# EAGLE design MicroMod_Processor_STM32WB5MMG (EAGLE 9.6.2)
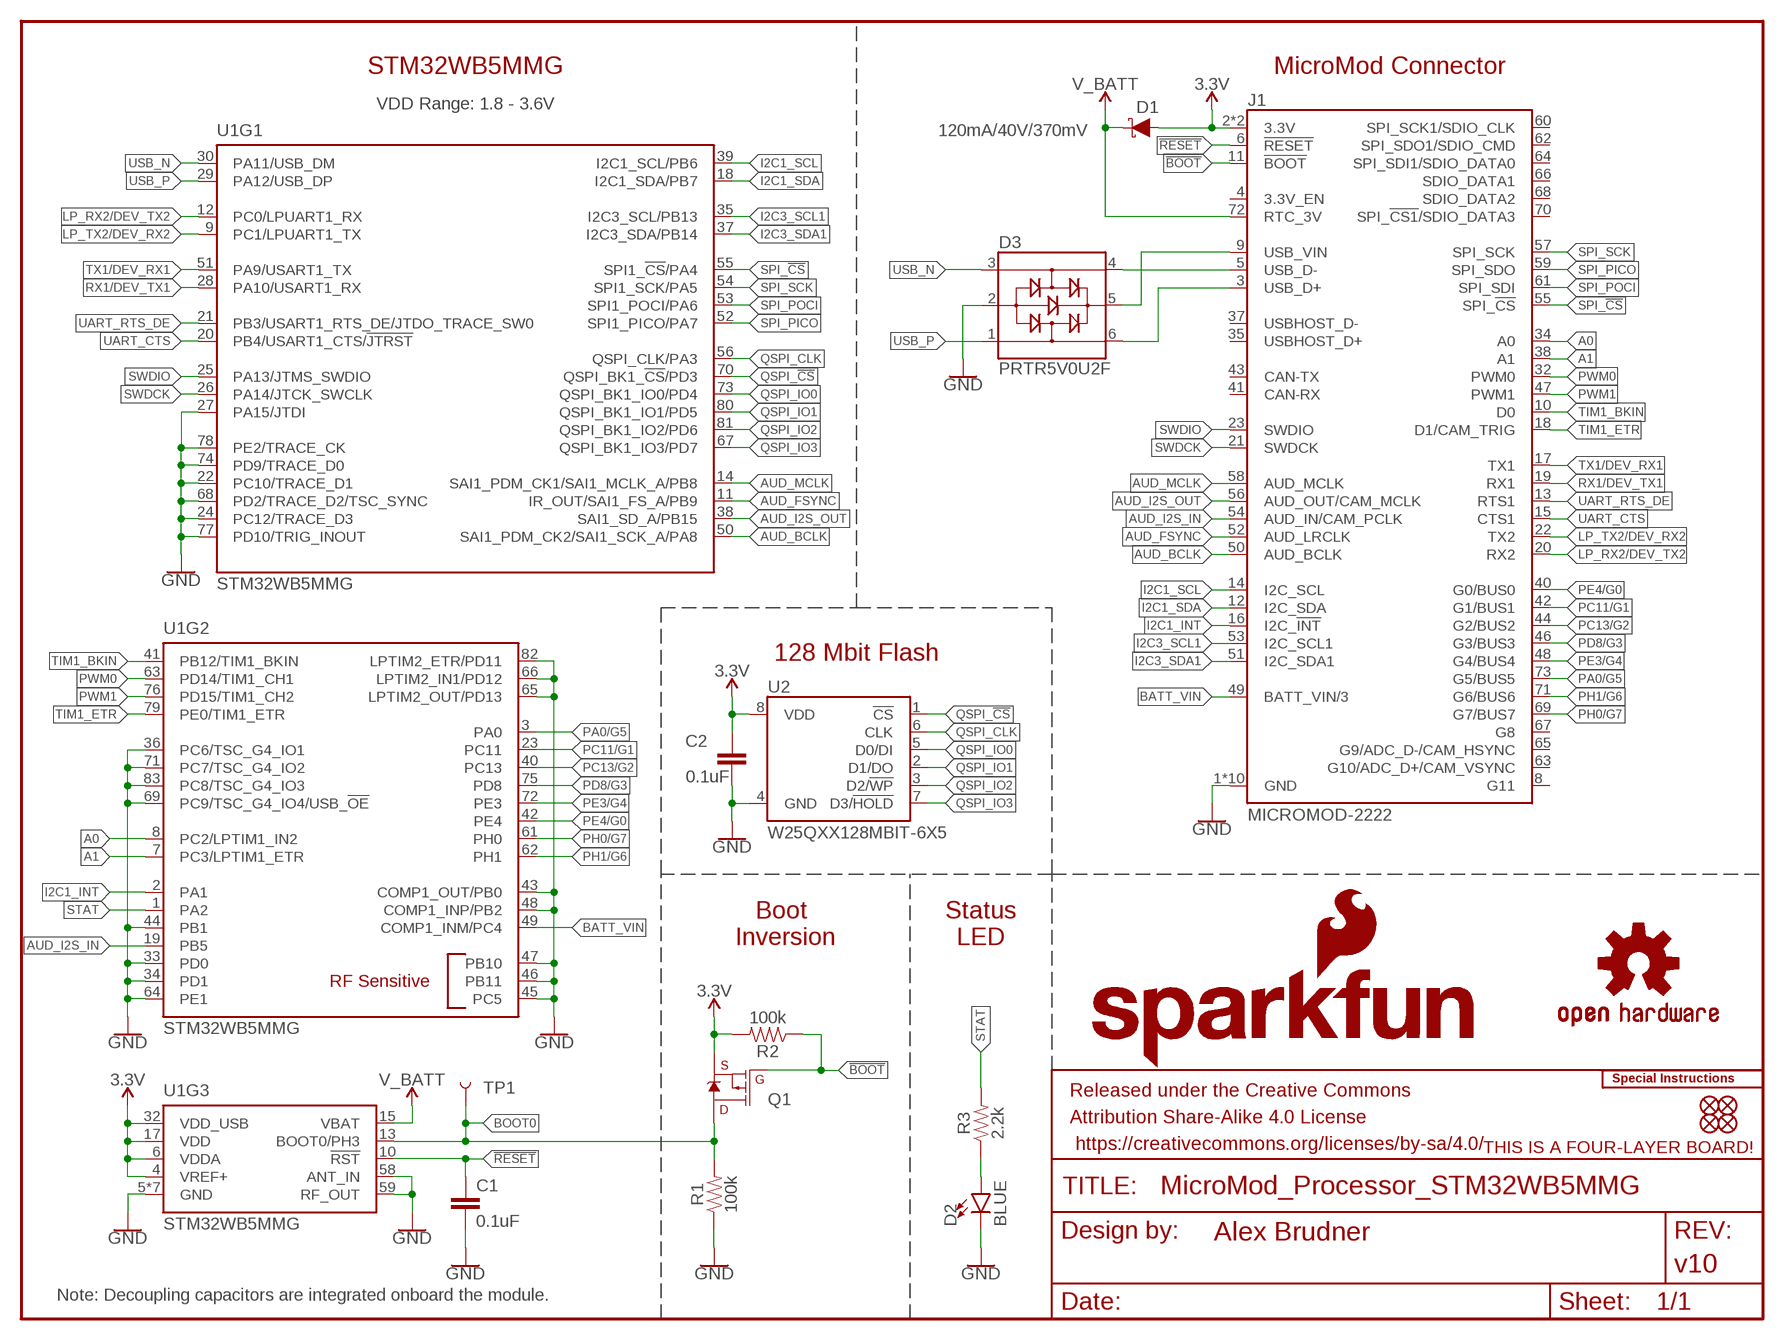
[diagram p0: schematic, sheet 1]

## Parts
C1  0.1uF  0.1UF-0402T-10V-10%-X7R  [0402-TIGHT]
C2  0.1uF  0.1UF-0402T-10V-10%-X7R  [0402-TIGHT]
D1  120mA/40V/370mV  DIODE-SCHOTTKY-RB751S40  [SOD-523]
D2  BLUE  LED-BLUE0603  [LED-0603]
D3  PRTR5V0U2F  [SOT886]
FD1  FIDUCIALUFIDUCIAL  [FIDUCIAL-MICRO]
FD2  FIDUCIALUFIDUCIAL  [FIDUCIAL-MICRO]
FD3  FIDUCIALUFIDUCIAL  [FIDUCIAL-MICRO]
FD4  FIDUCIALUFIDUCIAL  [FIDUCIAL-MICRO]
FRAME2  FRAME-LETTER  [CREATIVE_COMMONS]
J1  MICROMOD-2222  [M.2-CARD-E-22]
LOGO1  FOUR_LAYER_WARNING  [FOUR_LAYER_WARNING]
LOGO2  OSHW-LOGOMINI  [OSHW-LOGO-MINI]
LOGO3  SFE_LOGO_NAME_FLAME.1_INCH  [SFE_LOGO_NAME_FLAME_.1]
LOGO4  SPECIAL_INSTRUCTIONS-ORDERING  [ORDERING_INSTRUCTIONS]
Q1  20V/4.2A/52mΩ/1.4W  MOSFET_PCH-DMG2305UX-7  [SOT23-3]
R1  100k  100KOHM-0402T-1/16W-1%  [0402-TIGHT]
R2  100k  100KOHM-0402T-1/16W-1%  [0402-TIGHT]
R3  2.2k  2.2KOHM-0402T-1/16W-1%  [0402-TIGHT]
TP1  TEST-POINT3  [PAD.03X.03]
U1  STM32WB5MMG  STM32WB5MMG_LOGICAL  [SIP-LGA86]
U2  W25QXX128MBIT-6X5  [WSON-8-6X5]

## Nets
3.3V [Power]: C2.1 D1.A J1.2(3.3V) J1.74(3.3V) Q1.2(S) R2.2 U1.4(VREF+) U1.6(VDDA) U1.17(VDD) U1.32(VDD_USB) U2.8(VDD)
!BOOT!: J1.11(!BOOT!) Q1.1(G) R2.1
!RESET!: C1.1 J1.6(!RESET!) U1.10(!RST!)
A0: J1.34(A0) U1.8(PC2/LPTIM1_IN2)
A1: J1.38(A1) U1.7(PC3/LPTIM1_ETR)
AUD_BCLK: J1.50(AUD_BCLK) U1.50(SAI1_PDM_CK2/SAI1_SCK_A/PA8)
AUD_FSYNC: J1.52(AUD_LRCLK) U1.11(IR_OUT/SAI1_FS_A/PB9)
AUD_I2S_IN: J1.54(AUD_IN/CAM_PCLK) U1.19(PB5)
AUD_I2S_OUT: J1.56(AUD_OUT/CAM_MCLK) U1.38(SAI1_SD_A/PB15)
AUD_MCLK: J1.58(AUD_MCLK) U1.14(SAI1_PDM_CK1/SAI1_MCLK_A/PB8)
BATT_VIN: J1.49(BATT_VIN/3) U1.49(COMP1_INM/PC4)
BOOT0: Q1.3(D) R1.2 TP1.1 U1.13(BOOT0/PH3)
GND: C1.2 C2.2 D2.C D3.2 J1.1(GND) J1.7(GND) J1.33(GND) J1.36(GND) J1.39(GND) J1.45(GND) J1.75(GND) J1.GND1(GND) J1.GND2(GND) J1.GND3(GND) R1.1 U1.5(GND) U1.16(GND) U1.22(PC10/TRACE_D1) U1.24(PC12/TRACE_D3) U1.27(PA15/JTDI) U1.31(GND) U1.33(PD0) U1.34(PD1) U1.36(PC6/TSC_G4_IO1) U1.43(COMP1_OUT/PB0) U1.44(PB1) U1.45(PC5) U1.46(PB11) U1.47(PB10) U1.48(COMP1_INP/PB2) U1.57(GND) U1.58(ANT_IN) U1.59(RF_OUT) U1.60(GND) U1.64(PE1) U1.65(LPTIM2_OUT/PD13) U1.66(LPTIM2_IN1/PD12) U1.68(PD2/TRACE_D2/TSC_SYNC) U1.69(PC9/TSC_G4_IO4/USB_!OE!) U1.71(PC7/TSC_G4_IO2) U1.74(PD9/TRACE_D0) U1.77(PD10/TRIG_INOUT) U1.78(PE2/TRACE_CK) U1.82(LPTIM2_ETR/PD11) U1.83(PC8/TSC_G4_IO3) U1.84(GND) U1.86(GND) U2.4(GND)
I2C1_INT: J1.16(I2C_!INT!) U1.2(PA1)
I2C1_SCL: J1.14(I2C_SCL) U1.39(I2C1_SCL/PB6)
I2C1_SDA: J1.12(I2C_SDA) U1.18(I2C1_SDA/PB7)
I2C3_SCL1: J1.53(I2C_SCL1) U1.35(I2C3_SCL/PB13)
I2C3_SDA1: J1.51(I2C_SDA1) U1.37(I2C3_SDA/PB14)
LP_RX2/DEV_TX2: J1.20(RX2) U1.12(PC0/LPUART1_RX)
LP_TX2/DEV_RX2: J1.22(TX2) U1.9(PC1/LPUART1_TX)
N$1: D2.A R3.1
N$4: D3.5 J1.9(USB_VIN)
PA0/G5: J1.73(G5/BUS5) U1.3(PA0)
PC11/G1: J1.42(G1/BUS1) U1.23(PC11)
PC13/G2: J1.44(G2/BUS2) U1.40(PC13)
PD8/G3: J1.46(G3/BUS3) U1.75(PD8)
PE3/G4: J1.48(G4/BUS4) U1.72(PE3)
PE4/G0: J1.40(G0/BUS0) U1.42(PE4)
PH0/G7: J1.69(G7/BUS7) U1.61(PH0)
PH1/G6: J1.71(G6/BUS6) U1.62(PH1)
PWM0: J1.32(PWM0) U1.63(PD14/TIM1_CH1)
PWM1: J1.47(PWM1) U1.76(PD15/TIM1_CH2)
QSPI_!CS!: U1.70(QSPI_BK1_!CS!/PD3) U2.1(!CS!)
QSPI_CLK: U1.56(QSPI_CLK/PA3) U2.6(CLK)
QSPI_IO0: U1.73(QSPI_BK1_IO0/PD4) U2.5(D0/DI)
QSPI_IO1: U1.80(QSPI_BK1_IO1/PD5) U2.2(D1/DO)
QSPI_IO2: U1.81(QSPI_BK1_IO2/PD6) U2.3(D2/!WP!)
QSPI_IO3: U1.67(QSPI_BK1_IO3/PD7) U2.7(D3/!HOLD!)
RX1/DEV_TX1: J1.19(RX1) U1.28(PA10/USART1_RX)
SPI_!CS!: J1.55(SPI_!CS!) U1.55(SPI1_!CS!/PA4)
SPI_PICO: J1.59(SPI_SDO) U1.52(SPI1_PICO/PA7)
SPI_POCI: J1.61(SPI_SDI) U1.53(SPI1_POCI/PA6)
SPI_SCK: J1.57(SPI_SCK) U1.54(SPI1_SCK/PA5)
STAT: R3.2 U1.1(PA2)
SWDCK: J1.21(SWDCK) U1.26(PA14/JTCK_SWCLK)
SWDIO: J1.23(SWDIO) U1.25(PA13/JTMS_SWDIO)
TIM1_BKIN: J1.10(D0) U1.41(PB12/TIM1_BKIN)
TIM1_ETR: J1.18(D1/CAM_TRIG) U1.79(PE0/TIM1_ETR)
TX1/DEV_RX1: J1.17(TX1) U1.51(PA9/USART1_TX)
UART_CTS: J1.15(CTS1) U1.20(PB4/USART1_CTS/!JTRST!)
UART_RTS_DE: J1.13(RTS1) U1.21(PB3/USART1_RTS_DE/JTDO_TRACE_SW0)
USB_N [USB_Diff]: D3.3 U1.30(PA11/USB_DM)
USB_P [USB_Diff]: D3.1 U1.29(PA12/USB_DP)
USBIN_N [USB_Diff]: D3.4 J1.5(USB_D-)
USBIN_P [USB_Diff]: D3.6 J1.3(USB_D+)
V_BATT [Power]: D1.C J1.72(RTC_3V) U1.15(VBAT)
Unconnected: J1.4(3.3V_EN) J1.8(G11) J1.35(USBHOST_D+) J1.37(USBHOST_D-) J1.41(CAN-RX) J1.43(CAN-TX) J1.60(SPI_SCK1/SDIO_CLK) J1.62(SPI_SDO1/SDIO_CMD) J1.63(G10/ADC_D+/CAM_VSYNC) J1.64(SPI_SDI1/SDIO_DATA0) J1.65(G9/ADC_D-/CAM_HSYNC) J1.66(SDIO_DATA1) J1.67(G8) J1.68(SDIO_DATA2) J1.70(SPI_!CS1!/SDIO_DATA3)

## Notes on the sheet
- STM32WB5MMG | MicroMod Connector
- VDD Range: 1.8 - 3.6V
- 128 Mbit Flash
- Boot 
  Inversion
- Status
  LED
- Note: Decoupling capacitors are integrated onboard the module.

## Library data of the parts
C1 C2 = SparkFun-Capacitors:0.1UF: 0.1µF ceramic capacitors A capacitor is a passive two-terminal electrical component used to store electrical energy temporarily in an electric field.; PROD_ID: CAP-15083
D1 = SparkFun-DiscreteSemi:DIODE-SCHOTTKY: Schottky diode A Schottky diode is a semiconductor diode which has a low forward voltage drop and a very fast switching action.; PROD_ID: DIO-11018
D2 = SparkFun-LED:LED-BLUE: Blue SMD LED Used in manufacturing of various products at SparkFun Packages: 0603 - SMD 0603 package [Product Link] <http://www.digikey.com/product-detail/en/SMLE12BC7TT86/511-1589-2-ND/1641808> 1206 - SMD1206 package [Product Link] <http://www.digikey.com/product-detail/en/lite-on-inc/LTST-C150TBKT/160-1643-1-ND/573584> SparkFun Products: ESP8266 Thing-Dev Board <https://www.sparkfun.com/products/13711> RedBoard <https://www.sparkfun.com/products/12757>; PROD_ID: DIO-08575
D3 = SparkFun-IC-Power:PRTR5V0U2: A small ESD protection device. Most commonly used on USB D+/D- signals to protect large, expensive, or especially sensitive USB enabled devices.; PROD_ID: DIO-14084
FD1-FD4 = SparkFun-Aesthetics:FIDUCIAL: Fiducial Alignment Points Point-of-reference for pick-and-place machines and other optical instruments.
FRAME2 = SparkFun-Aesthetics:FRAME-LETTER: Schematic Frame - Letter Standard 8.5x11 US Letter frame; DESIGNER: Alex Brudner; REV: v10
J1 = SparkFun-MicroMod:MICROMOD: MicroMod Connector Description: A card edge connector and mating PCB connector to allow various MicroMod Processor Boards to be coupled with various carrier boards of different capabilities. Based on the M.2 standard.
LOGO1 = SparkFun-Aesthetics:FOUR_LAYER_WARNING: Four-Layer Board Warning - tDoc Layer Warning text which will appear on both the schematic and the board file, notifying viewers that the design is a four-layer PCB.
LOGO2 = SparkFun-Aesthetics:OSHW-LOGO: Open-Source Hardware (OSHW) Logo This logo indicates the piece of hardware it is found on incorporates a OSHW license and/or adheres to the definition of open source hardware found here: http://freedomdefined.org/OSHW
LOGO3 = SparkFun-Aesthetics:SFE_LOGO_NAME_FLAME: SparkFun Font Logo w/ Flame This is the SparkFun full logo. The logo on the schematic will always be the same size; the package variant is the height of the flame part of the logo. Default layer for the logo on the board is tSilk.
LOGO4 = SparkFun-Aesthetics:SPECIAL_INSTRUCTIONS: Special Ordering/Production Instructions Alert Symbol for special PCB ordering instructions or unique production process warnings. Ordering Instructions Production Instructions Types of information that should be added to box: Copper weight Soldermask color Silk color PCB thickness Number of layers PCB Standard: 1.6mm FR4 1 oz copper immersion silver plating red soldermask white silkscreen Types of information that should be added to box: Special wash requirements Depaneling instructions Humidification Glue curing Default text settings: 0.07 inch 9% ratio 50% line distance
Q1 = SparkFun-DiscreteSemi:MOSFET_PCH: P-channel MOSFETs Voltage controlled devices that allow control of high current outputs. SparkFun Products: SparkFun ESP32 Thing <https://www.sparkfun.com/products/13907> SparkFun ESP8266 Thing <https://www.sparkfun.com/products/13231> SparkFun Pi Servo HAT V2 <https://www.sparkfun.com/products/15316> DMG2305UX-7 (20V/4.2A/SOT23-3); PROD_ID: TRANS-14388
R1 R2 = SparkFun-Resistors:100KOHM: 100kΩ resistor A resistor is a passive two-terminal electrical component that implements electrical resistance as a circuit element. Resistors act to reduce current flow, and, at the same time, act to lower voltage levels within circuits. - Wikipedia; PROD_ID: RES-13495
R3 = SparkFun-Resistors:2.2KOHM: 2.2kΩ resistor A resistor is a passive two-terminal electrical component that implements electrical resistance as a circuit element. Resistors act to reduce current flow, and, at the same time, act to lower voltage levels within circuits. - Wikipedia; PROD_ID: RES-14341
TP1 = SparkFun-Connectors:TEST-POINT: SparkFun Test Points Bare copper test points for troubleshooting or In-Circuit-Testing. These are used by our Production team for verifying production board runs using pogo-pins on test beds. SparkFun Products: SparkFun LSM9DS1 Breakout <https://www.sparkfun.com/products/13284> SparkFun PSOC <https://www.sparkfun.com/products/13714> SparkFun Load Cell Amplifier <https://www.sparkfun.com/products/13879>
U1 = stm32wb5mmg:STM32WB5MMG; PROD_ID: IC-17415
U2 = SparkFun-IC-Memory:W25QXX; PROD_ID: IC-15107

## Net classes
1 USB_Diff: width 0.25 mm, clearance 0.2 mm to class 0, clearance 0.2 mm
2 Power: width 0.25 mm

## Board
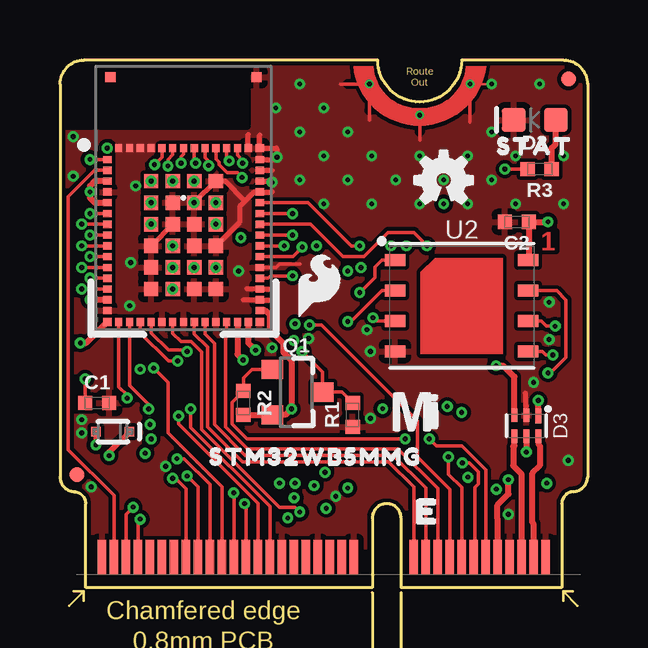
[diagram p1: board, top side]
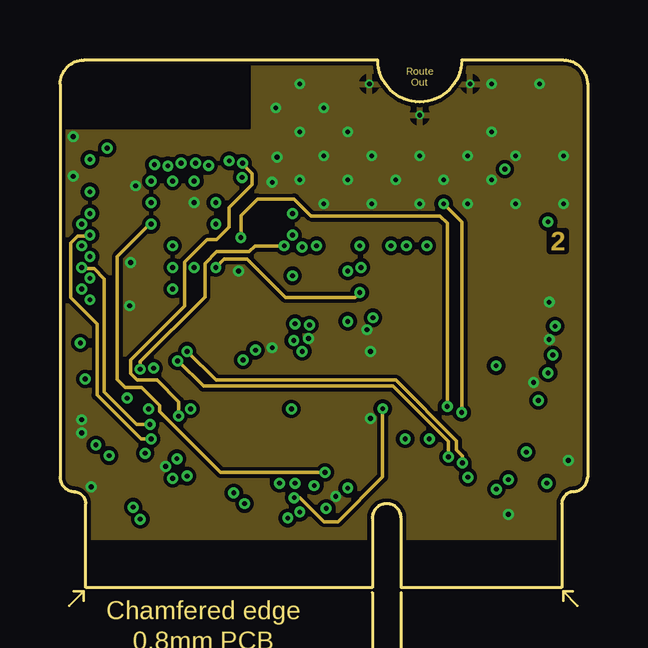
[diagram p2: board, inner layer Route2]
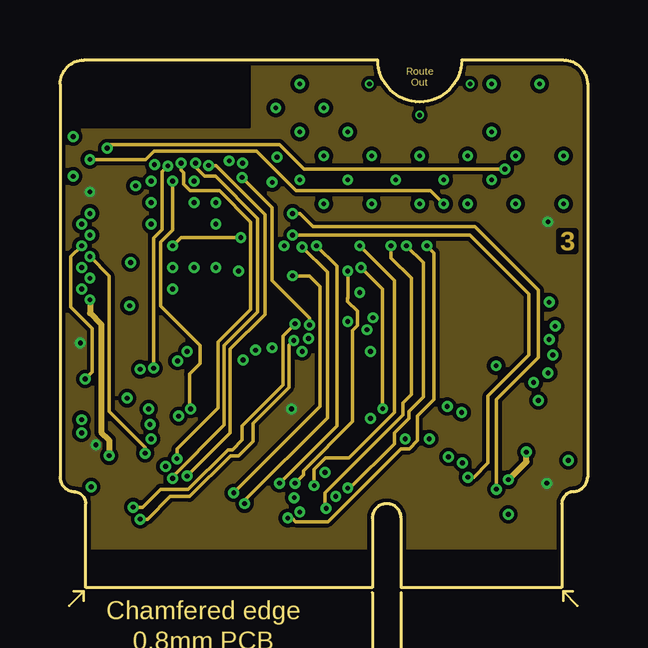
[diagram p3: board, inner layer Route15]
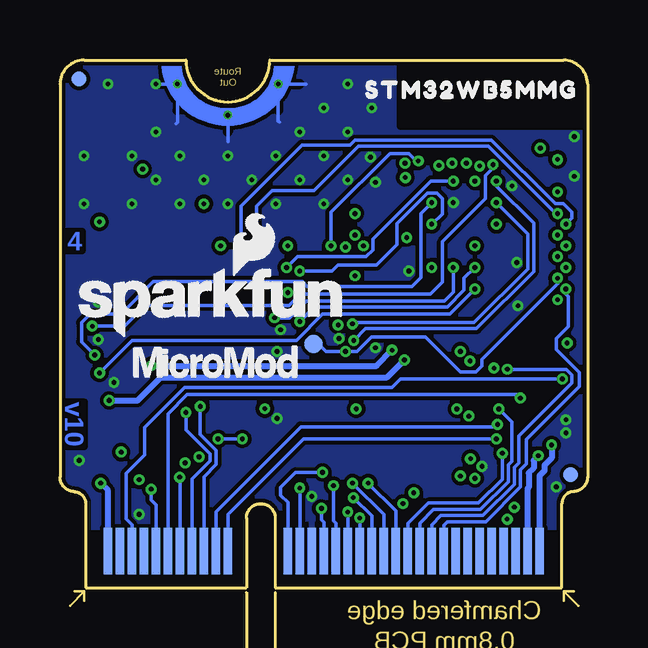
[diagram p4: board, bottom side, seen from below]

Size 22 x 22 mm. Coordinates in mm from the lower left corner, seen from the top.
Outline: 16.75,22 21,22 arc-87 22,21 22,4.6 arc-87 21.4,4 arc85 20.93,3.5 20.93,0 14.22,0 14.22,2.9 arc180 13.03,2.9 13.03,0 1.07,0 1.07,3.5 arc84 0.6,4 arc-87 0,4.6 0,21 arc-87 1,22 13.25,22
Outline: 16.75,22 arc-180 13.25,22
Outline: 16.75,22 arc-180 13.25,22
Copper layers (1+2*15+16): Top 0.035mm / dielectric 0.2mm / Route2 0.0175mm / dielectric 0.265mm / Route15 0.0175mm / dielectric 0.2mm / Bottom 0.035mm
Design rules "SparkFun-4-Layer-MicroMod-CZ7628-JLCPCB *": minimum track width 4mil, minimum drill 0.2mm, track to track 4mil, track to pad 4mil, pad to pad 4mil, via to via 4mil, smd to smd 4mil, copper to edge 6mil, drill to drill 6mil, minimum pad ring 3mil, minimum via ring 5mil, stop-mask expansion 2.5mil, vias tented up to drill 25mil, thermal gap 10mil
tRestrict: area 8.2,12.2 to 8.4,12.2; area 8.2,17.6 to 8.4,17.6; area 8.2,17.1 to 8.4,17.2; area 8.2,16.7 to 8.4,16.8

### Footprints (pad centres in the part's own frame; a part is rotated, then mirrored left to right if it is on the bottom)
0402-TIGHT = smd 0.6 x 0.6: 1 -0.5,0; 2 0.5,0
SOD-523 = smd 0.4 x 0.4: A -0.7,0; C 0.7,0
LED-0603 = smd 1 x 1: A -0.877,0; C 0.877,0
SOT886 = smd 0.61 x 0.25: 1 -0.405,0.5 | smd 0.56 x 0.25: 2 -0.43,0; 3 -0.43,-0.5; 4 0.43,-0.5; 5 0.43,0; 6 0.43,0.5
FIDUCIAL-MICRO = smd 0.635 x 0.635: 1 0,0
M.2-CARD-E-22 = smd 0.35 x 1.45: 1 9.25,1.275; 3 8.75,1.275; 5 8.25,1.275; 7 7.75,1.275; 9 7.25,1.275; 11 6.75,1.275; 13 6.25,1.275; 15 5.75,1.275; 17 5.25,1.275; 19 4.75,1.275; 21 4.25,1.275; 23 3.75,1.275; 33 1.25,1.275; 35 0.75,1.275; 37 0.25,1.275; 39 -0.25,1.275; 41 -0.75,1.275; 43 -1.25,1.275; 45 -1.75,1.275; 47 -2.25,1.275; 49 -2.75,1.275; 51 -3.25,1.275; 53 -3.75,1.275; 55 -4.25,1.275; 57 -4.75,1.275; 59 -5.25,1.275; 61 -5.75,1.275; 63 -6.25,1.275; 65 -6.75,1.275; 67 -7.25,1.275; 69 -7.75,1.275; 71 -8.25,1.275; 73 -8.75,1.275; 75 -9.25,1.275 | smd 0.35 x 1.95 bottom: 2 9,1.525; 4 8.5,1.525; 6 8,1.525; 8 7.5,1.525; 10 7,1.525; 12 6.5,1.525; 14 6,1.525; 16 5.5,1.525; 18 5,1.525; 20 4.5,1.525; 22 4,1.525; 32 1.5,1.525; 34 1,1.525; 36 0.5,1.525; 38 0,1.525; 40 -0.5,1.525; 42 -1,1.525; 44 -1.5,1.525; 46 -2,1.525; 48 -2.5,1.525; 50 -3,1.525; 52 -3.5,1.525; 54 -4,1.525; 56 -4.5,1.525; 58 -5,1.525; 60 -5.5,1.525; 62 -6,1.525; 64 -6.5,1.525; 66 -7,1.525; 68 -7.5,1.525; 70 -8,1.525; 72 -8.5,1.525; 74 -9,1.525 | drill 0.2: GND1 1.9,21; GND2 4,19.7; GND3 6.1,21
SOT23-3 = smd 0.8 x 0.9: 1 -0.95,-1; 2 0.95,-1; 3 0,1.1
PAD.03X.03 = smd 0.762 x 0.762: 1 0,0
SIP-LGA86 = smd 0.35 x 0.35: 1 -3.175,2.075; 17 -3.175,-5.175; 31 3.175,-5.175; 47 3.175,2.075 | smd 0.35 x 0.3: 2 -3.175,1.6; 3 -3.175,1.15; 4 -3.175,0.7; 5 -3.175,0.25; 6 -3.175,-0.2; 7 -3.175,-0.65; 8 -3.175,-1.1; 9 -3.175,-1.55; 10 -3.175,-2; 11 -3.175,-2.45; 12 -3.175,-2.9; 13 -3.175,-3.35; 14 -3.175,-3.8; 15 -3.175,-4.25; 16 -3.175,-4.7; 32 3.175,-4.7; 33 3.175,-4.25; 34 3.175,-3.8; 35 3.175,-3.35; 36 3.175,-2.9; 37 3.175,-2.45; 38 3.175,-2; 39 3.175,-1.55; 40 3.175,-1.1; 41 3.175,-0.65; 42 3.175,-0.2; 43 3.175,0.25; 44 3.175,0.7; 45 3.175,1.15; 46 3.175,1.6 | smd 0.3 x 0.35: 18 -2.7,-5.175; 19 -2.25,-5.175; 20 -1.8,-5.175; 21 -1.35,-5.175; 22 -0.9,-5.175; 23 -0.45,-5.175; 24 0,-5.175; 25 0.45,-5.175; 26 0.9,-5.175; 27 1.35,-5.175; 28 1.8,-5.175; 29 2.25,-5.175; 30 2.7,-5.175; 48 2.7,2.075; 49 2.25,2.075; 50 1.8,2.075; 51 1.35,2.075; 52 0.9,2.075; 53 0.45,2.075; 54 0,2.075; 55 -0.45,2.075; 56 -0.9,2.075; 57 -1.35,2.075; 58 -1.8,2.075; 59 -2.25,2.075; 60 -2.7,2.075 | smd 0.6 x 0.6: 61 -1.35,0.7; 62 -1.35,-0.2; 63 -1.35,-1.1; 64 -1.35,-2; 65 -1.35,-2.9; 66 -1.35,-3.8; 67 -0.45,-3.8; 68 0.45,-3.8; 69 1.35,-3.8; 70 1.35,-2.9; 71 1.35,-2; 72 1.35,-1.1; 73 1.35,-0.2; 74 1.35,0.7; 75 0.45,0.7; 76 -0.45,0.7; 77 -0.45,-0.2; 78 -0.45,-1.1; 79 -0.45,-2; 80 -0.45,-2.9; 81 0.45,-2.9; 82 0.45,-2; 83 0.45,-1.1; 84 0.45,-0.2 | smd 0.43 x 0.43: 85 -3.05,5.035; 86 3.05,5.035
WSON-8-6X5 = smd 0.85 x 0.5: 1 -2.775,1.905; 2 -2.775,0.635; 3 -2.775,-0.635; 4 -2.775,-1.905; 5 2.775,-1.905; 6 2.775,-0.635; 7 2.775,0.635; 8 2.775,1.905

### Placement (x,y rotation side)
C1  1.55,7.7 0 top
C2  19.05,15.25 180 top
D1  2.2,6.5 0 top
D2  19.8,19.5 180 top
D3  19.45,6.75 270 top
FD1  0.7,4.7 0 top
FD2  21.2,21.2 0 top
FD3  0.7,4.7 0 bottom
FD4  21.2,21.2 0 bottom
FRAME2  52.1,-18.55 0 top  (outside the outline)
J1  11,0 0 top
LOGO1  28.4,30.35 0 top  (outside the outline)
LOGO2  16,17 0 top
LOGO3  15.65,11.9 0 bottom
LOGO4  25.7,42.55 0 top  (outside the outline)
Q1  9.85,8.15 270 top
R1  12.2,7.2 90 top
R2  7.65,7.7 270 top
R3  20,17.45 180 top
TP1  11.43,10.16 0 bottom
U1  5.15,16.25 0 top
U2  16.75,11.75 0 top
U$1  [MICROMOD_MI_LOGO_.35]  14.8,7.35 0 top
U$2  [MICROMOD_LOGO_.3]  15.55,9.35 0 bottom
U$3  [SFE_LOGO_FLAME_.1]  10.8,12.6 0 top
U$4  [STM32WB5MMG0]  10.65,5.45 0 top
U$5  [STM32WB5MMG0]  4.85,20.75 0 bottom
U$6  [SFE_LOGO_FLAME_STOP_.1]  19.25,19.8 0 bottom
U$7  [STAT0]  19.8,18.4 0 top

### Tracks (layer width: path | path; a pad name or v marks a point on that pad's centre or on a via)
3.3V  (via drill 0.2)
  Top 0.25: R2.2 Q1.2 9.4,7.2 v9.65,7.45 9.65,9.48 9.3,9.82 9.3,10.2 8.75,10.75 8.75,11.37 8.57,11.55 U1.32 | 0.92,10.2 v0.85,10.2 1.1,10.2 U1.17 | D1.A v1.5,5.95 | U2.8 19.55,13.68 C2.1 v20.35,15.25 | U1.4 1.45,16.95 1.25,16.75 v1.25,16.5 1.25,16.25 1.45,16.05 U1.6
  Bottom 0.25: J1.2 20,4.05 v20.3,4.35 | v1.5,5.95 1.5,5.4 1.8,5.1 1.8,4.88 2,4.67 J1.74
  pour Route15 (isolate 0.152, rank 2): 0,22 0,1.7 22,1.7 22,22
!BOOT!  (via drill 0.2)
  Top 0.15: Q1.1 8,9.1 7.65,8.75 R2.1 7.17,7.72 7.17,6.83 7.81,6.19 v14.4,6.19 | J1.11 17.75,4.9 16.75,5.9 15.7,5.9 v15.4,6.2
  Route2 0.15: v14.4,6.2 v14.4,6.19
  Bottom 0.15: v15.4,6.2 v15.39,6.19 v14.4,6.19
!RESET!  (via drill 0.2)
  Top 0.15: U1.10 v0.9,14.25 | C1.1 v1.05,8.7
  Route15 0.15: v0.9,14.25 0.45,13.8 0.45,11.7 1.35,10.8 1.35,9 v1.05,8.7
  Bottom 0.15: J1.6 19,2.62 19.25,2.87 19.25,4.75 18.48,5.53 18.48,6.67 16.8,8.35 8.16,8.35 7.81,8.7 v1.05,8.7
A0  (via drill 0.2)
  Top 0.15: U1.8 v0.9,15.15
  Route15 0.15: v14.45,14.25 15.15,13.55 15.15,7.95 14.55,7.35 14.55,7.05 13.95,6.45 13.95,6 12.1,4.15 v12,4.15
  Bottom 0.15: J1.34 v12,4.15 | v0.9,15.15 0.65,15.4 0.65,15.65 1,16 1.35,16 4,18.65 9.7,18.65 9.91,18.45 11.9,18.45 14.45,15.9 v14.45,14.25
A1  (via drill 0.2)
  Top 0.15: U1.7 v1.25,15.6
  Route15 0.15: v13.8,14.25 13.8,13.75 14.65,12.9 14.65,8.05 14.3,7.7 14.3,7.2 11.05,3.95 11.05,3.35 v11.1,3.3
  Bottom 0.15: v1.25,15.6 1.33,15.6 4.13,18.4 9.55,18.4 11.4,16.55 13.15,16.55 13.8,15.9 v13.8,14.25 | v11.1,3.3 11.1,2.83 11,2.73 J1.38
AUD_BCLK  (via drill 0.2)
  Top 0.15: v7.06,17.79 v7.05,17.79 6.95,17.89 U1.50
  Route15 0.15: v9.15,4.35 11.55,6.75 11.55,13.4 v10.7,14.25
  Bottom 0.15: v9.15,4.35 8,3.2 J1.50 | v10.7,14.25 10.7,15.65 8.25,18.1 7.45,18.1 7.14,17.79 v7.06,17.79
AUD_FSYNC  (via drill 0.2)
  Top 0.15: U1.11 v1.25,13.8
  Route15 0.15: v1.25,13.8 2.05,13 2.05,7.35 3.55,5.85 v3.55,5.6
  Bottom 0.15: J1.52 7.5,2.67 6.64,3.53 4.54,3.53 3.56,4.51 3.56,5.21 3.55,5.21 v3.55,5.6
AUD_I2S_IN  (via drill 0.2)
  Top 0.15: U1.19 2.9,8.43 3.7,7.63 v3.7,7.45
  Bottom 0.15: J1.54 7,2.68 6.42,3.25 4.46,3.25 3.3,4.41 3.3,5.11 3.15,5.26 3.15,6.9 v3.7,7.45
AUD_I2S_OUT  (via drill 0.2)
  Top 0.15: U1.38 v9.35,14.25
  Route2 0.15: v9.35,14.25 8.14,14.25 7.89,14 6.53,14 6.05,13.52 6.05,12.12 3.35,9.42 v3.35,9.11 v3.34,9.1
  Bottom 0.15: v3.34,9.1 0.88,9.1 0.65,8.87 0.65,8.53 2.85,6.32 2.85,5.2 3.05,5 3.05,4.3 4.35,3 6.12,3 6.5,2.62 J1.56
AUD_MCLK  (via drill 0.2)
  Top 0.15: U1.14 v0.91,12.45 v0.91,12.44
  Bottom 0.15: v0.91,12.44 0.91,12.24 0.81,12.14 0.81,10.89 1.31,10.39 1.31,9.93 0.35,8.97 0.35,8.38 2.55,6.17 2.55,5.15 2.8,4.9 2.8,4.2 4.25,2.75 5.85,2.75 6,2.6 J1.58
BATT_VIN  (via drill 0.2)
  Top 0.15: v7.62,17.7 7.62,17.8 7.4,18.02 U1.49 | J1.49 8.25,3.52 4.95,6.82 v4.95,7.15
  Route2 0.15: v7.62,17.7 7.62,17.65 8,17.27 8,16.8 7.05,15.85 7.05,15.03 6.52,14.5 6.13,14.5 5.2,13.57 5.2,11.75 2.94,9.49 2.94,8.94 3.23,8.65 4.05,8.65 4.95,7.75 v4.95,7.15
BOOT0  (via drill 0.2)
  Top 0.15: R1.2 11.75,8.15 Q1.3 10.95,9 v10.1,9.85 | U1.13 v1.25,12.9
  Bottom 0.15: v1.25,12.9 1.25,12.67 4.4,9.52 4.4,9.25 4.65,9 5.3,9 6.75,10.45 9.02,10.45 9.62,9.85 v10.1,9.85 10.9,9.85 11.21,10.16 TP1.1
GND  (via drill 0.2)
  Top 0.15: 12.9,19.5 J1.GND1 11.7,21 | J1.GND2 15,18.65 | J1.GND3 17.1,19.4 | U1.36 9,13.35 9.15,13.5 10,13.5
  Top 0.2: 8.85,12.45 U1.34 7.8,12.45 | 7.65,12 U1.33 8.95,12 | U1.71 7.5,15.25 7.5,15.9 7.72,16.12 | 7.72,16.12 8.1,16.5 U1.43 8.85,16.5 | 7.72,16.12 6.9,16.95 U1.74 U1.84 | U1.46 8.95,17.85 v9.05,17.95 9.05,18.3 9.03,18.32 U1.47 8.32,18.88 | U1.48 7.85,18.9 | U1.45 8.85,17.4 | U1.44 8.8,16.95 v8.85,16.9 | U1.78 U1.64 | D3.2 19.45,7.55 19.42,7.58 19.42,8.08 19.4,8.1
  Bottom 0.15: J1.GND2 15,18.6 | 17.15,19.35 17.1,19.4 J1.GND3 v18,21 | 11.75,21 J1.GND1 12.9,19.45 12.85,19.4
  other vias: 5.6,16.05 8.85,10 10,19 11,18 9,20 10,21 11,20 10,17 11,16 12,17 13,16 12,19 13,18 14,17 15,16 16,17 17,16 18,17 19,16 21,16 21,18 18,19 17,18 15,18 20,21 19,18 12.95,7.05 11.5,3.8 21.2,5.3 1.3,4.2 0.9,7 2.95,13.55 0.9,6.45 20.4,10.35 3.15,16.75 0.55,17.15 0.55,18.8 4.4,5.05 12.95,9.85 2.9,11.75 18.7,3.05 7.45,13.2 12.8,10.75 19.75,8.55 20.4,11.9 10.37,10.38
  pour Top (isolate 0.152, rank 2): 0,22 0,1.7 22,1.7 22,22
  pour Route2 (isolate 0.152, rank 2): 0,22 0,2.1 22,2.1 22,22
  pour Bottom (isolate 0.152, rank 2): 0,22 0,2.5 22,2.5 22,22
  cutout Route2: 7.9,22 7.9,19.15 0,19.15 0,22
  pour Top (no thermals): 2.38,19 4.15,19 4.15,18.75 3.95,18.55 3.95,18.2 3.55,17.8 2.38,17.8 2.38,18.57 2.2,18.75 2.2,18.82
  pour Top (no thermals): 6.45,14.2 7.1,14.2 7.1,14.85
GND1
  cutout Route15: 7.9,22 7.9,19.2 0,19.2 0,22
I2C1_INT  (via drill 0.2)
  Top 0.15: U1.2 v1.25,17.85
  Route2 0.15: v16,16 16.75,15.25 v16.75,7.3
  Route15 0.15: v1.25,17.85 3.58,17.85 3.92,18.19 8.21,18.19 9.85,16.55 15.45,16.55 v16,16
  Bottom 0.15: v16.75,7.3 16.75,6.57 15.75,5.57 15.75,5.28 16.5,4.53 J1.16
I2C1_SCL  (via drill 0.2)
  Top 0.15: U1.39 v9.7,14.7
  Route15 0.15: v9.7,14.7 17.1,14.7 19.55,12.25 19.55,9.7 17.85,8 17.85,5.2 17.25,4.6 v17.01,4.6
  Bottom 0.15: v17.01,4.6 v17,4.59 J1.14
I2C1_SDA  (via drill 0.2)
  Top 0.15: U1.18 2.45,8.38 2.8,8.03 v2.8,7.9
  Bottom 0.15: v2.8,7.9 2.95,8.05 16.7,8.05 17.5,7.25 J1.12
I2C3_SCL1  (via drill 0.2)
  Top 0.15: v9.7,13 8.78,13 8.68,12.9 U1.35 | v7.25,3.95 J1.53
  Route15 0.15: v9.7,13 10.4,13 10.85,12.55 10.85,7.55 v7.25,3.95
I2C3_SDA1  (via drill 0.2)
  Top 0.15: v10.1,14.2 10.1,14.18 9.72,13.8 U1.37 | v7.7,3.5 7.75,3.45 J1.51
  Route15 0.15: v10.1,14.2 11.15,13.15 11.15,7.08 7.7,3.63 v7.7,3.5
LP_RX2/DEV_TX2  (via drill 0.2)
  Top 0.15: U1.12 v0.9,13.35
  Route2 0.15: v0.9,13.35 0.95,13.3 1.42,13.3 1.85,12.87 1.85,8.15 3.2,6.8 v3.75,6.8
  Bottom 0.15: J1.20 15.5,3.15 11.95,6.7 3.85,6.7 v3.75,6.8
LP_TX2/DEV_RX2  (via drill 0.2)
  Top 0.15: U1.9 v1.25,14.7
  Route2 0.15: v1.25,14.7 1.2,14.65 0.73,14.65 0.45,14.37 0.45,12.1 1.55,11 1.55,8.03 3.38,6.2 v3.8,6.2
  Bottom 0.15: J1.22 15,3.05 11.85,6.2 v3.8,6.2
N$1
  Top 0.25: R3.1 20.5,18.32 20.68,18.5 D2.A
N$4  (via drill 0.2)
  Top 0.25: J1.9 18.25,2.86 18.25,3.45 18.7,3.9 v18.7,4.5 | D3.5 v19.45,5.65
  Route15 0.25: v18.7,4.5 19.45,5.25 v19.45,5.65
PA0/G5
  Top 0.15: J1.73 2.25,3.85 0.35,5.75 0.35,16.3 1.45,17.4 U1.3
PC11/G1  (via drill 0.2)
  Top 0.15: U1.23 4.7,10.6 5.05,10.25 5.47,10.25 5.9,9.82 5.9,6.6 9.16,3.34 9.81,3.34 v10,3.15
  Bottom 0.15: v10,3.15 J1.42
PC13/G2  (via drill 0.2)
  Top 0.15: U1.40 10.45,15.15 11.8,13.8 12.68,13.8 13.68,14.8 14.77,14.8 15.3,14.27 v15.3,14.25
  Route15 0.15: v9.5,2.9 9.68,2.9 9.83,2.75 11.17,2.75 14.21,5.79 14.56,5.79 14.9,6.13 14.9,7.15 15.6,7.85 15.6,13.95 v15.3,14.25
  Bottom 0.15: J1.44 v9.5,2.9
PD8/G3  (via drill 0.2)
  Route2 0.15: v13.46,7.46 13.46,4.61 11.6,2.75 11.02,2.75 10.02,3.75 v9.77,3.75
  Route15 0.15: v13.46,7.46 13.45,7.47 13.45,10.43 13.45,12.45 v12.55,13.35
  Bottom 0.15: J1.46 9,2.98 v9.77,3.75 | v12.55,13.35 12.1,13.8 9.23,13.8 8.95,14.08 8.95,14.54 6.54,16.95 U1.75
  other vias: 5.6,16.95
PE3/G4  (via drill 0.2)
  Route15 0.15: v9.8,4.35 10.15,4.7 10.15,4.88 12.21,6.93 12.21,10.73 12.4,10.92 12.4,11.53 12,11.93 12,12.07 v12,13.2
  Bottom 0.15: J1.48 8.5,3.05 v9.8,4.35 | U1.72 6.48,15.15 6.05,15.58 6.05,16.22 6.28,16.45 6.68,16.45 7.95,15.18 7.95,14.3 8.8,13.45 10.4,13.45 10.65,13.2 v12,13.2
  other vias: 6.5,15.15
PE4/G0  (via drill 0.2)
  Top 0.15: U1.42 9.35,16.05 10.35,16.05 12.15,14.25 v12.5,14.25
  Route15 0.15: v12.5,14.25 13.95,12.8 13.95,7.3 12.05,5.4 11.08,5.4 10.6,4.92 v10.6,4.25
  Bottom 0.15: v10.6,4.25 10.6,2.77 10.5,2.67 J1.40
PH0/G7  (via drill 0.2)
  Top 0.15: J1.69 3.25,2.75 v3.35,2.85
  Route15 0.15: v9.75,10.3 9.55,10.11 9.55,8.35 8.05,6.84 8.05,6.1 7.45,5.5 7.1,5.5 5.4,3.79 4.6,3.79 3.66,2.85 v3.35,2.85
  Bottom 0.15: v9.75,10.3 9.26,10.79 4.63,10.79 2.25,13.18 2.25,15.2 3.8,16.75 U1.61
  other vias: 3.8,16.95
PH1/G6  (via drill 0.2)
  Top 0.15: v3.05,3.35 2.75,3.05 J1.71
  Route15 0.15: v9.8,11 9.3,10.5 9.3,8.45 7.6,6.75 7.6,6.15 7.2,5.75 7,5.75 5.35,4.1 4.2,4.1 3.45,3.35 v3.05,3.35
  Bottom 0.15: v9.8,11 9.75,11 9.7,11.05 4.73,11.05 2.5,13.28 2.5,14.75 U1.62
  other vias: 3.8,16.05
PWM0  (via drill 0.2)
  Route2 0.15: U1.63 3.74,15.15 2.39,13.79 2.39,8.68 2.72,8.35 3.4,8.35 4.15,7.6 4.15,7.35 6.7,4.8 v11.05,4.8
  Bottom 0.15: J1.32 12.5,3.55 12.8,3.85 12.8,4.17 12.17,4.8 v11.05,4.8
  other vias: 3.8,15.15
PWM1  (via drill 0.2)
  Top 0.15: v5.45,7.45 5.45,6.68 8.75,3.38 J1.47
  Route15 0.15: v5.45,7.45 5.4,7.5 5.4,8.9 5.85,9.35 5.85,10.1 4.2,11.75 4.2,14.4 4.7,14.9 U1.76
  other vias: 4.7,16.95
QSPI_!CS!  (via drill 0.2)
  Top 0.15: v12.5,12.3 13.12,12.93 13.12,13.36 13.43,13.65 U2.1
  Route2 0.15: U1.70 6.85,13.7 7.8,13.7 9.4,12.1 12.3,12.1 v12.5,12.3
  other vias: 6.5,13.35
QSPI_CLK  (via drill 0.2)
  Top 0.15: v20.65,10.9 20.29,10.9 20.07,11.12 U2.6 | v3.94,17.64 4.25,17.95 U1.56
  Bottom 0.15: v20.65,10.9 19.3,10.9 18.44,11.76 12.44,11.76 11.95,12.25 6.55,12.25 6.05,12.75 6.05,14.42 4.25,16.22 4.25,17.17 3.94,17.48 v3.94,17.64
QSPI_IO0  (via drill 0.2)
  Top 0.15: v20.55,9.7 20.25,9.7 20.11,9.85 U2.5
  Bottom 0.15: v20.55,9.7 21.1,10.25 21.1,11.05 20.75,11.4 19.46,11.4 18.1,12.75 11.9,12.75 11.69,12.55 7.33,12.55 6.95,12.93 6.95,15.6 U1.73
  other vias: 6.5,16.05
QSPI_IO1  (via drill 0.2)
  Top 0.15: U2.2 13.43,12.38 12.14,11.1 v12,11.1
  Bottom 0.15: U1.80 5.15,12.9 5.15,12.4 5.85,11.7 11.4,11.7 v12,11.1
  other vias: 4.7,13.35
QSPI_IO2  (via drill 0.2)
  Top 0.15: v13.05,11.25 13.19,11.12 U2.3
  Bottom 0.15: U1.81 5.6,12.33 5.98,11.95 11.73,11.95 12.43,11.25 v13.05,11.25
  other vias: 5.6,13.35
QSPI_IO3  (via drill 0.2)
  Top 0.15: U2.7 20.71,12.38 21.1,12 21.1,9.6 20.45,8.95 v20.35,8.95
  Bottom 0.15: U1.67 5.75,11.4 11.04,11.4 12.14,10.3 19,10.3 v20.35,8.95
  other vias: 4.7,12.45
RX1/DEV_TX1
  Top 0.15: J1.19 15.75,4.13 14.09,5.79 7.82,5.79 6.9,6.71 6.9,10.72 6.95,10.78 U1.28
SPI_!CS!  (via drill 0.2)
  Top 0.15: U1.55 4.7,18.05 4.5,17.85 v4.5,17.58 | v3.9,9.15 4.5,8.55 4.5,6.45 6.75,4.2 J1.55
  Route15 0.15: v3.9,9.15 3.9,14.58 4.25,14.93 4.25,17.33 v4.5,17.58
SPI_PICO  (via drill 0.2)
  Top 0.15: v6.2,17.6 6.2,17.77 6.05,17.93 U1.52 | v5.3,4.65 5.75,4.2 J1.59
  Route15 0.15: v6.2,17.6 6.5,17.6 8.55,15.55 8.55,11.39 7.1,9.94 7.1,6.45 v5.3,4.65
SPI_POCI  (via drill 0.2)
  Top 0.15: U1.53 5.6,17.73 5.62,17.7 v5.65,17.7 | v4.7,4.55 4.83,4.55 5.25,4.12 J1.61
  Route15 0.15: v5.65,17.7 5.7,17.65 5.7,17.48 6.03,17.15 6.5,17.15 8.25,15.4 8.25,11.49 6.85,10.09 6.85,6.77 4.7,4.62 v4.7,4.55
SPI_SCK  (via drill 0.2)
  Top 0.15: v4.88,5.37 5.18,5.37 6.25,4.3 J1.57 | U1.54 5.15,18.07 5.05,17.98 v5.05,17.7
  Route15 0.15: v5.05,17.7 5.05,17.4 5.15,17.3 5.15,16.83 5.43,16.55 6.65,16.55 7.95,15.25 7.95,11.6 6.6,10.25 6.6,7.5 4.88,5.78 v4.88,5.37
STAT  (via drill 0.2)
  Top 0.15: U1.1 v1.97,18.33 | v18.55,17.45 R3.2
  Route15 0.15: v18.55,17.45 10.17,17.45 9.15,18.47 2.12,18.47 v1.97,18.33
SWDCK
  Top 0.15: J1.21 15.25,4.17 13.89,5.52 7.72,5.52 6.45,6.79 6.45,10.18 6.05,10.57 U1.26
SWDIO
  Top 0.15: J1.23 14.75,4.2 13.7,5.25 7.61,5.25 6.15,6.71 6.15,10.03 5.6,10.57 U1.25
TIM1_BKIN  (via drill 0.2)
  Top 0.15: U1.41 v9.7,15.6
  Route15 0.15: v9.7,15.6 10,15.6 10.55,15.05 17.3,15.05 19.95,12.4 19.95,9.6 18.2,7.85 v18.2,4.1
  Bottom 0.15: J1.10 18,3.45 18.2,3.65 v18.2,4.1
TIM1_ETR  (via drill 0.2)
  Route2 0.15: v7.54,14.6 7.54,15.51 8.23,16.2 9.77,16.2 10.47,15.5 15.85,15.5 16.15,15.2 v16.15,7.55
  Route15 0.15: U1.79 5.05,14.6 v7.54,14.6
  Bottom 0.15: v16.15,7.55 16.15,6.38 15.49,5.72 15.49,5.13 16,4.62 J1.18
  other vias: 4.7,14.25
TX1/DEV_RX1  (via drill 0.2)
  Top 0.15: v7.6,17.1 7.4,17.3 6.97,17.3 6.64,17.64 6.64,17.73 6.5,17.88 U1.51 | J1.17 16.25,4.1 14.9,5.45 14.9,6.95 10.9,10.95 v10.4,10.95
  Route15 0.15: v7.6,17.1 8.85,15.85 8.85,12.8 10.4,11.25 v10.4,10.95
UART_CTS  (via drill 0.2)
  Top 0.15: U1.20 3.35,10.62 4.53,9.45 v4.9,9.45 | v16.2,5.45 16.2,4.72 16.75,4.17 J1.15
  Route2 0.15: v4.9,9.45 4.93,9.45 5.98,8.4 13.9,8.4 16.2,6.09 v16.2,5.45
UART_RTS_DE  (via drill 0.2)
  Top 0.15: U1.21 3.8,10.62 4.53,9.9 5.25,9.9 v5.3,9.85 | v16.78,5.2 17.08,5.2 17.45,4.83 17.45,4.33 17.3,4.17 17.3,1.32 J1.13
  Route2 0.15: v5.3,9.85 6.5,8.65 14,8.65 16.53,6.12 16.53,5.75 16.78,5.5 v16.78,5.2
USB_N  (via drill 0.2)
  Top 0.25: v8.15,9.9 7.85,10.2 U1.30 | v18.19,9.25 18.49,9.25 18.95,8.79 D3.3
  Bottom 0.25: v8.15,9.9 8.8,9.25 v18.19,9.25
USB_P  (via drill 0.2)
  Top 0.25: v7.64,9.49 7.4,9.72 U1.29 | D3.1 v19.95,7.8
  Bottom 0.25: v7.64,9.49 8.36,8.77 17.8,8.77 18.77,7.8 v19.95,7.8
USBIN_N
  Top 0.25: D3.4 18.95,5.92 18.9,5.87 18.9,5.08 19.25,4.73 19.25,2.14 19.25,2.13 J1.5
USBIN_P
  Top 0.25: D3.6 19.95,5.97 20,5.92 20,5.08 19.7,4.78 19.7,2.7 19.75,2.65 J1.3
V_BATT  (via drill 0.2)
  Top 0.25: U1.15 v1.25,12 | D1.C 2.05,5.65 v2.05,5.5
  Route15 0.25: v2.05,5.5 2.05,6.15 1.72,6.48 1.72,10.97 1.25,11.44 v1.25,12
  Bottom 0.25: v2.05,5.5 2.25,5.3 2.25,4.97 2.45,4.78 2.45,4.17 2.5,4.12 J1.72

### Text on the board
Top: 1
Route2: 2
Route15: 3
Bottom: 4 | v10
Measures: Units in mm.
tDocu: Thickness: 0.8mm | Beveled Edge | ENIG Finish | Stackup: JLC7628 | Material: TG155 | Solder Mask: Red | Alex Brudner